# EAGLE schematic Vumeter (EAGLE 7.3.0)
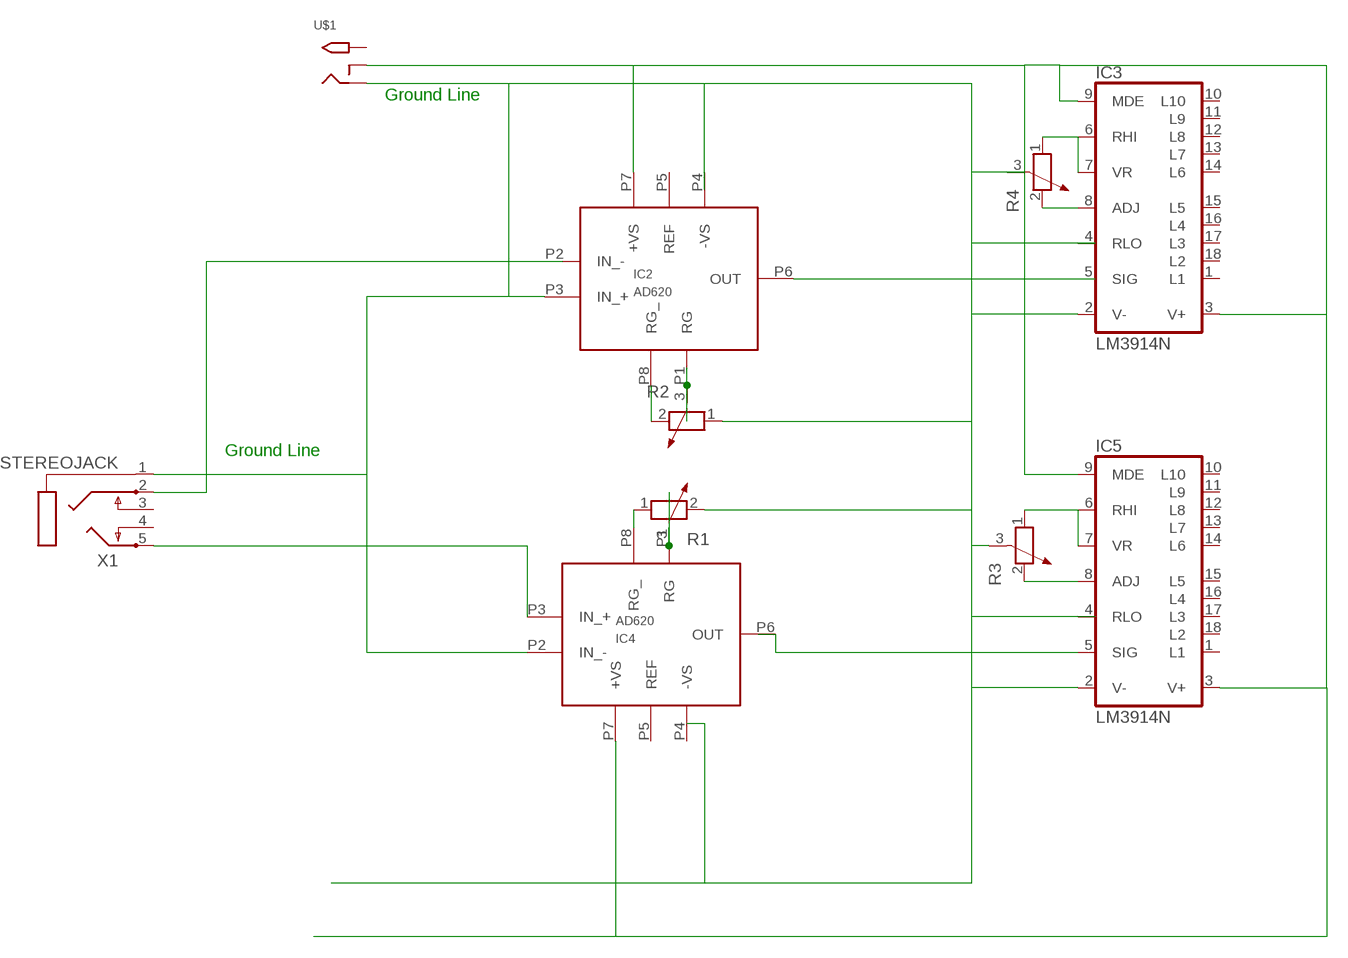
[diagram p0: schematic, sheet 1]

## Parts
IC2  AD620  [DIL8]
IC3  LM3914N  [DIL18]
IC4  AD620  [DIL8]
IC5  LM3914N  [DIL18]
R1  POTENTIOMETER_PT-10  [PT-10]
R2  POTENTIOMETER_PT-10  [PT-10]
R3  POTENTIOMETER_PT-10  [PT-10]
R4  POTENTIOMETER_PT-10  [PT-10]
U$1  2.1MMJACKTHM  [PJ-102A]
X1  STEREOJACK  [STX3100]

## Nets
N$1: IC4.P8(RG_) R1.1
N$20: IC3.6(RHI) IC3.7(VR) R4.1
N$21: IC2.P7(+VS) IC3.3(V+) IC3.9(MDE) IC4.P7(+VS) IC5.3(V+) IC5.9(MDE)
N$23: IC2.P8(RG_) R2.2
N$24: R2.3
N$26: IC4.P1(RG) R1.3
N$27: IC4.P3(IN_+) X1.5
N$28: X1.2
N$29: IC2.P3(IN_+) IC3.2(V-) IC4.P2(IN_-) IC5.2(V-) R1.2 R2.1 R3.3 U$1.RING X1.1
N$30: IC2.P6(OUT)
N$31: IC5.5(SIG)
N$32: IC5.6(RHI) IC5.7(VR) R3.1
N$33: IC5.8(ADJ) R3.2
N$34: IC3.8(ADJ) R4.2
Unconnected: IC2.P1(RG) IC2.P2(IN_-) IC3.1(L1) IC3.4(RLO) IC3.5(SIG) IC3.10(L10) IC3.11(L9) IC3.12(L8) IC3.13(L7) IC3.14(L6) IC3.15(L5) IC3.16(L4) IC3.17(L3) IC3.18(L2) IC4.P6(OUT) IC5.1(L1) IC5.4(RLO) IC5.10(L10) IC5.11(L9) IC5.12(L8) IC5.13(L7) IC5.14(L6) IC5.15(L5) IC5.16(L4) IC5.17(L3) IC5.18(L2) R4.3 U$1.RING_SW U$1.TIP X1.3 X1.4

## Notes on the sheet
- Ground Line
- Ground Line

## Power pins joined to a net without a drawn wire
-VS: IC2.P4(-VS) IC4.P4(-VS)
REF: IC2.P5(REF) IC4.P5(REF)

## Library data of the parts
IC2 IC4 = ad620:AD620; MF: ALTERA CORPORATION; MPN: AD620ARZ; OC_NEWARK: 82H2866
IC3 IC5 = linear:LM3914N: LED DRIVER senses analog voltage levels and drives 10 LEDs; MF: NATIONAL SEMICONDUCTOR; MPN: LM3914N-1/NOPB; OC_NEWARK: 33K4103
R1-R4 = rcl:POTENTIOMETER_: Potentiometer
U$1 = adafruit:2.1MMJACK: 2.1mm x 5.5mm THM DC jack with internal switch. Digikey part #PJ-102A, 4UCON part #05537 2.1mm x 5.5mm SMT DC jack with internal switch. Digikey part #PJ-002A-SMT, 4UCON part #03267 By microbuilder.eu & adafruit.com; OC_NEWARK: unknown
X1 = adafruit:STEREOJACK: MIC/HEADPHONE JACK Stereo jack with two switches. Kycon STX3100, CUI SJ1-3555NG and/or 4UCon 05544; OC_NEWARK: unknown